# EAGLE design schematic (EAGLE 7.6.0)
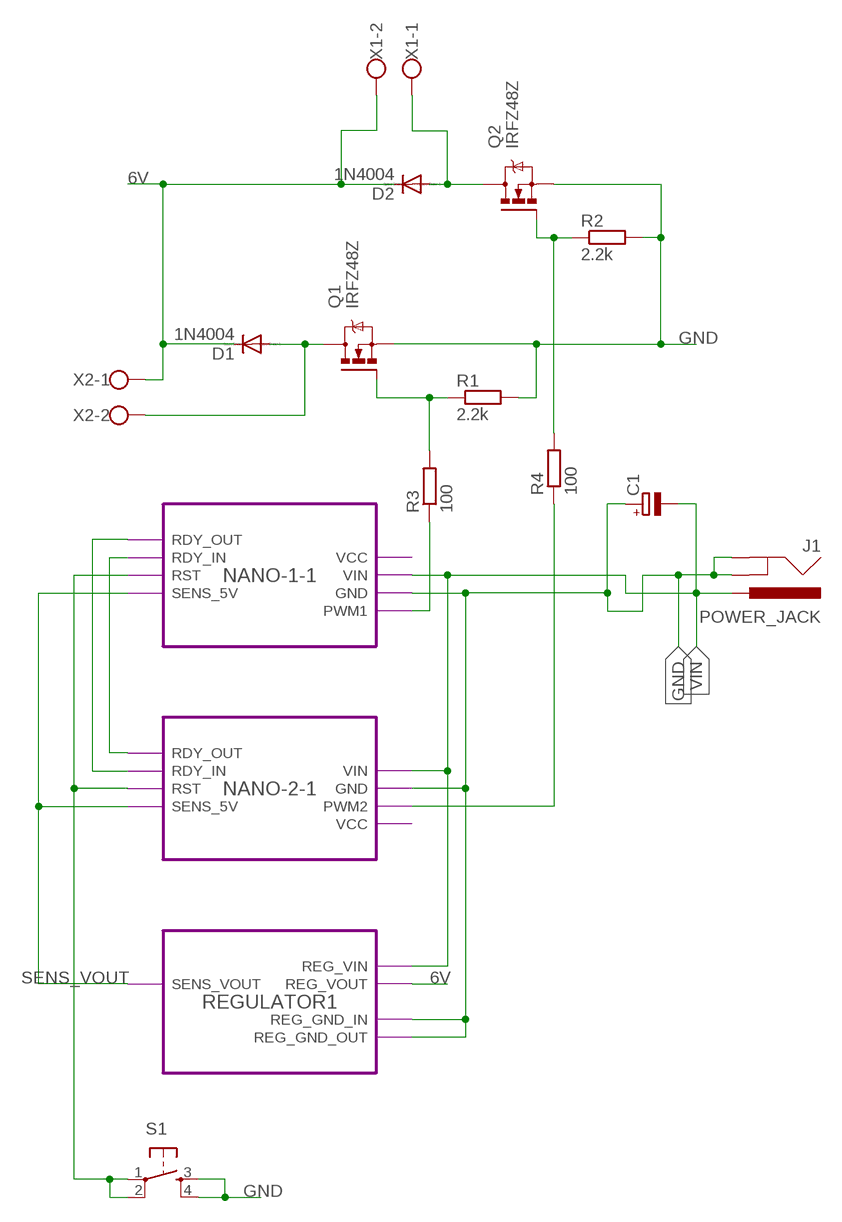
[diagram p0: schematic, sheet 1]

## Parts
C1  CPOL-EUE2.5-6  [E2,5-6]
D1  1N4004  [DO41-10]
D2  1N4004  [DO41-10]
J1  POWER_JACK  [POWER_JACK_PTH]
Q1  IRFZ48Z  [TO220BH]
Q2  IRFZ48Z  [TO220BH]
R1  2.2k  R-EU_0204/7  [0204/7]
R2  2.2k  R-EU_0204/7  [0204/7]
R3  100  R-EU_0204/7  [0204/7]
R4  100  R-EU_0204/7  [0204/7]
S1  TAC_SWITCHPTH  [TACTILE-PTH]
X1  W237-102  [W237-102]
X2  W237-102  [W237-102]

## Module instances
NANO-1-1 = NANO-1
NANO-2-1 = NANO-2
REGULATOR1 = REGULATOR

## Nets
6V: D1.C D2.C X1.2 X2.1 ; port REGULATOR1.REG_VOUT
GND: C1.+ J1.GND J1.GNDBREAK Q1.S Q2.S R1.2 R2.2 S1.3 S1.4 ; port NANO-2-1.GND NANO-1-1.GND REGULATOR1.REG_GND_OUT REGULATOR1.REG_GND_IN
N$1: Q1.G R1.1 R3.2
N$2: port NANO-2-1.RDY_OUT NANO-1-1.RDY_IN
N$3: R4.1 ; port NANO-2-1.PWM2
N$4: port NANO-1-1.RDY_OUT NANO-2-1.RDY_IN
N$5: D1.A Q1.D X2.2
N$6: D2.A Q2.D X1.1
N$7: R3.1 ; port NANO-1-1.PWM1
N$8: Q2.G R2.1 R4.2
N$9: S1.1 S1.2 ; port NANO-2-1.RST NANO-1-1.RST
SENS_VOUT: port REGULATOR1.SENS_VOUT NANO-2-1.SENS_5V NANO-1-1.SENS_5V
VIN: C1.- J1.PWR ; port NANO-1-1.VIN NANO-2-1.VIN REGULATOR1.REG_VIN

## Library data of the parts
C1 = rcl:CPOL-EU: POLARIZED CAPACITOR, European symbol
D1 D2 = diode:1N4004: DIODE general purpose rectifier, 1 A
J1 = SparkFun-Connectors:POWER_JACK: Power Jack Connector This is the standard 5.5mm barrel jack for power. The PTH is the most common, proven, reliable, footprint. The Slot footprint only works if the mill layer is transmitted to the PCB fab house so be warned. Here are the connectors we sell at SparkFun: DC Barrel Power Jack/Connector <https://www.sparkfun.com/products/119> (PRT-00119) DC Barrel Power Jack/Connector (SMD) <https://www.sparkfun.com/products/12748> (PRT-12748) DC Barrel Jack Adapter - Breadboard Compatible <https://www.sparkfun.com/products/10811> (PRT-10811) It is used on this SparkFun product (and many, many others): SparkFun RedBoard - Programmed with Arduino <https://www.sparkfun.com/products/12757> (DEV-12757) Also, if you need a mating power supply or connector, please check these out: Wall Adapter Power Supply - 9VDC 650mA <https://www.sparkfun.com/products/298> (TOL-00298) DC Barrel Jack Adapter - Male <https://www.sparkfun.com/products/10287> (PRT-10287); PROD_ID: CONN-08197
Q1 Q2 = transistor-power:IRFZ48: N Channel HEXFET® Power MOSFET Logic Level Source: http://www.irf.com/product-info/datasheets/data/irfz48z.pdf
R1-R4 = rcl:R-EU_: RESISTOR, European symbol
S1 = SparkFun-Retired:TAC_SWITCH: Momentary Switch Button commonly used for reset or general input. Spark Fun Electronics SKU : COM-00097 SMT- SWCH-08247
X1 X2 = con-wago-500:W237-102: WAGO SCREW CLAMP; MPN: 237-102; OC_FARNELL: unknown; OC_NEWARK: 70K9898

## Module NANO-1
Ports: VIN(io) GND(io) PWM1(io) VCC(io) RDY_OUT(io) RDY_IN(io) RST(io) SENS_5V(io)
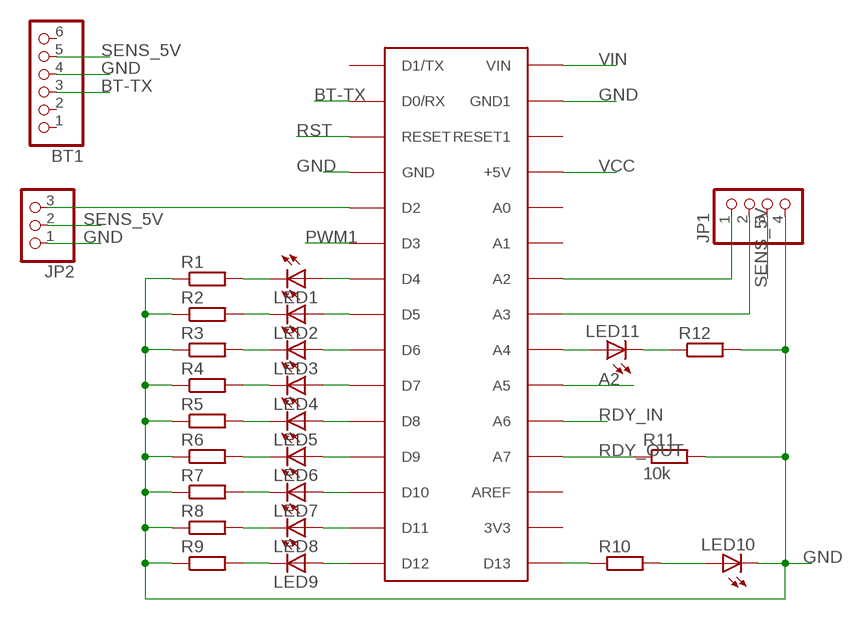
[diagram p1: schematic, module NANO-1, sheet 1]

### Parts
BT1  PINHD-1X6  [1X06]
JP1  PINHD-1X4  [1X04]
JP2  PINHD-1X3  [1X03]
LED1  LED5MM  [LED5MM]
LED2  LED5MM  [LED5MM]
LED3  LED5MM  [LED5MM]
LED4  LED5MM  [LED5MM]
LED5  LED5MM  [LED5MM]
LED6  LED5MM  [LED5MM]
LED7  LED5MM  [LED5MM]
LED8  LED5MM  [LED5MM]
LED9  LED5MM  [LED5MM]
LED10  LED5MM  [LED5MM]
LED11  LED5MM  [LED5MM]
R1  R-EU_0204/7  [0204/7]
R2  R-EU_0204/7  [0204/7]
R3  R-EU_0204/7  [0204/7]
R4  R-EU_0204/7  [0204/7]
R5  R-EU_0204/7  [0204/7]
R6  R-EU_0204/7  [0204/7]
R7  R-EU_0204/7  [0204/7]
R8  R-EU_0204/7  [0204/7]
R9  R-EU_0204/7  [0204/7]
R10  R-EU_0204/7  [0204/7]
R11  10k  R-EU_0204/7  [0204/7]
R12  R-EU_0204/7  [0204/7]
U$1  ARDUINONANO  [PDIP-32]

### Nets
A2: U$1.A5
BT-TX: BT1.3 U$1.D0/RX
GND: BT1.4 JP1.4 JP2.1 LED10.K(C) R1.1 R2.1 R3.1 R4.1 R5.1 R6.1 R7.1 R8.1 R9.1 R11.2 R12.2 U$1.GND U$1.GND1
N$1: LED9.A U$1.D12
N$2: LED8.A U$1.D11
N$3: LED7.A U$1.D10
N$4: LED6.A U$1.D9
N$5: LED5.A U$1.D8
N$6: LED4.A U$1.D7
N$7: LED3.A U$1.D6
N$8: LED2.A U$1.D5
N$9: LED1.A U$1.D4
N$10: R10.1 U$1.D13
N$11: LED1.K(C) R1.2
N$12: LED2.K(C) R2.2
N$13: LED3.K(C) R3.2
N$14: LED4.K(C) R4.2
N$15: LED5.K(C) R5.2
N$16: LED6.K(C) R6.2
N$17: LED7.K(C) R7.2
N$18: LED8.K(C) R8.2
N$19: LED9.K(C) R9.2
N$20: LED11.A U$1.A4
N$21: LED11.K(C) R12.1
N$22: LED10.A R10.2
N$23: JP1.1 U$1.A2
N$24: JP1.2 U$1.A3
N$25: JP2.3 U$1.D2
PWM1: U$1.D3
RDY_IN: U$1.A6
RDY_OUT: R11.1 U$1.A7
RST: U$1.RESET
SENS_5V: BT1.5 JP1.3 JP2.2
VCC: U$1.+5V
VIN: U$1.VIN
Unconnected: BT1.1 BT1.2 BT1.6 U$1.3V3 U$1.A0 U$1.A1 U$1.AREF U$1.D1/TX U$1.RESET1

### Library data of the parts
BT1 = pinhead:PINHD-1X6: PIN HEADER
JP1 = pinhead:PINHD-1X4: PIN HEADER
JP2 = pinhead:PINHD-1X3: PIN HEADER
LED1-LED11 = led:LED: LED OSRAM: - CHIPLED LG R971, LG N971, LY N971, LG Q971, LY Q971, LO R971, LY R971 LH N974, LH R974 LS Q976, LO Q976, LY Q976 LO Q996 - Hyper CHIPLED LW Q18S LB Q993, LB Q99A, LB R99A - SideLED LS A670, LO A670, LY A670, LG A670, LP A670 LB A673, LV A673, LT A673, LW A673 LH A674 LY A675 LS A676, LA A676, LO A676, LY A676, LW A676 LS A679, LY A679, LG A679 - Hyper Micro SIDELED® LS Y876, LA Y876, LO Y876, LY Y876 LT Y87S - SmartLED LW L88C, LW L88S LB L89C, LB L89S, LG L890 LS L89K, LO L89K, LY L89K LS L896, LA L896, LO L896, LY L896 - TOPLED LS T670, LO T670, LY T670, LG T670, LP T670 LSG T670, LSP T670, LSY T670, LOP T670, LYG T670 LG T671, LOG T671, LSG T671 LB T673, LV T673, LT T673, LW T673 LH T674 LS T676, LA T676, LO T676, LY T676, LB T676, LH T676, LSB T676, LW T676 LB T67C, LV T67C, LT T67C, LS T67K, LO T67K, LY T67K, LW E67C LS E67B, LA E67B, LO E67B, LY E67B, LB E67C, LV E67C, LT E67C LW T67C LS T679, LY T679, LG T679 LS T770, LO T770, LY T770, LG T770, LP T770 LB T773, LV T773, LT T773, LW T773 LH T774 LS E675, LA E675, LY E675, LS T675 LS T776, LA T776, LO T776, LY T776, LB T776 LHGB T686 LT T68C, LB T68C - Hyper Mini TOPLED® LB M676 - Mini TOPLED Santana® LG M470 LS M47K, LO M47K, LY M47K Source: http://www.osram.convergy.de LUXEON: - LUMILED® LXK2-PW12-R00, LXK2-PW12-S00, LXK2-PW14-U00, LXK2-PW14-V00 LXK2-PM12-R00, LXK2-PM12-S00, LXK2-PM14-U00 LXK2-PE12-Q00, LXK2-PE12-R00, LXK2-PE12-S00, LXK2-PE14-T00, LXK2-PE14-U00 LXK2-PB12-K00, LXK2-PB12-L00, LXK2-PB12-M00, LXK2-PB14-N00, LXK2-PB14-P00, LXK2-PB14-Q00 LXK2-PR12-L00, LXK2-PR12-M00, LXK2-PR14-Q00, LXK2-PR14-R00 LXK2-PD12-Q00, LXK2-PD12-R00, LXK2-PD12-S00 LXK2-PH12-R00, LXK2-PH12-S00 LXK2-PL12-P00, LXK2-PL12-Q00, LXK2-PL12-R00 Source: www.luxeon.com KINGBRIGHT: KA-3528ASYC Source: www.kingbright.com
R1-R12 = rcl:R-EU_: RESISTOR, European symbol
U$1 = jet-lib:ARDUINONANO

## Module NANO-2
Ports: VIN(io) GND(io) PWM2(io) VCC(io) RDY_OUT(io) RDY_IN(io) RST(io) SENS_5V(io)
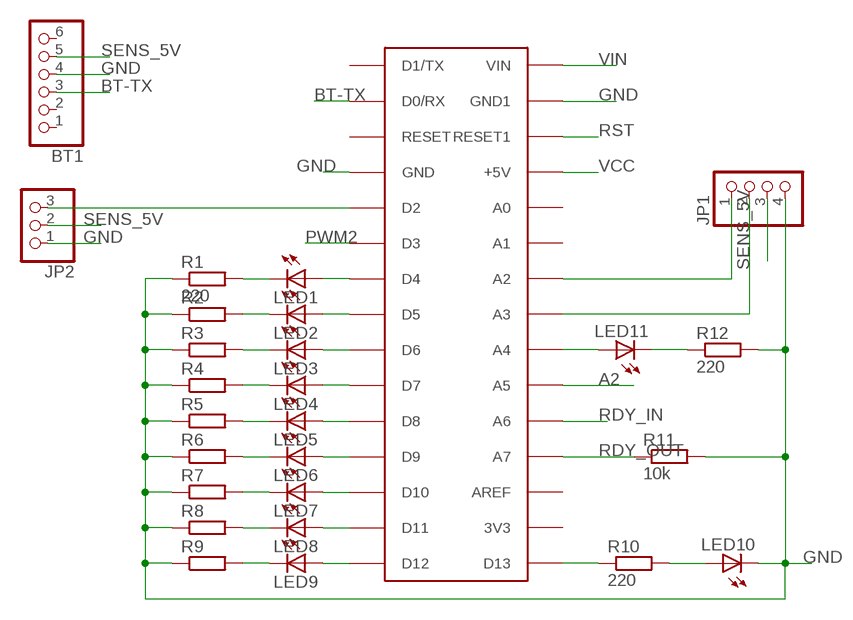
[diagram p2: schematic, module NANO-2, sheet 1]

### Parts
BT1  PINHD-1X6  [1X06]
JP1  PINHD-1X4  [1X04]
JP2  PINHD-1X3  [1X03]
LED1  LED5MM  [LED5MM]
LED2  LED5MM  [LED5MM]
LED3  LED5MM  [LED5MM]
LED4  LED5MM  [LED5MM]
LED5  LED5MM  [LED5MM]
LED6  LED5MM  [LED5MM]
LED7  LED5MM  [LED5MM]
LED8  LED5MM  [LED5MM]
LED9  LED5MM  [LED5MM]
LED10  LED5MM  [LED5MM]
LED11  LED5MM  [LED5MM]
R1  220  R-EU_0204/7  [0204/7]
R2  R-EU_0204/7  [0204/7]
R3  R-EU_0204/7  [0204/7]
R4  R-EU_0204/7  [0204/7]
R5  R-EU_0204/7  [0204/7]
R6  R-EU_0204/7  [0204/7]
R7  R-EU_0204/7  [0204/7]
R8  R-EU_0204/7  [0204/7]
R9  R-EU_0204/7  [0204/7]
R10  220  R-EU_0204/7  [0204/7]
R11  10k  R-EU_0204/7  [0204/7]
R12  220  R-EU_0204/7  [0204/7]
U$1  ARDUINONANO  [PDIP-32]

### Nets
A2: U$1.A5
BT-TX: BT1.3 U$1.D0/RX
GND: BT1.4 JP1.4 JP2.1 LED10.K(C) R1.1 R2.1 R3.1 R4.1 R5.1 R6.1 R7.1 R8.1 R9.1 R11.2 R12.2 U$1.GND U$1.GND1
N$1: LED9.A U$1.D12
N$2: LED8.A U$1.D11
N$3: LED7.A U$1.D10
N$4: LED6.A U$1.D9
N$5: LED5.A U$1.D8
N$6: LED4.A U$1.D7
N$7: LED3.A U$1.D6
N$8: LED2.A U$1.D5
N$9: LED1.A U$1.D4
N$10: LED11.K(C) R12.1
N$11: LED1.K(C) R1.2
N$12: LED2.K(C) R2.2
N$13: LED3.K(C) R3.2
N$14: LED4.K(C) R4.2
N$15: LED5.K(C) R5.2
N$16: LED6.K(C) R6.2
N$17: LED7.K(C) R7.2
N$18: LED8.K(C) R8.2
N$19: LED9.K(C) R9.2
N$20: LED11.A U$1.A4
N$21: R10.1 U$1.D13
N$22: LED10.A R10.2
N$23: JP1.1 U$1.A2
N$24: JP1.2 U$1.A3
N$25: JP2.3 U$1.D2
PWM2: U$1.D3
RDY_IN: U$1.A6
RDY_OUT: R11.1 U$1.A7
RST: U$1.RESET1
SENS_5V: BT1.5 JP1.3 JP2.2
VCC: U$1.+5V
VIN: U$1.VIN
Unconnected: BT1.1 BT1.2 BT1.6 U$1.3V3 U$1.A0 U$1.A1 U$1.AREF U$1.D1/TX U$1.RESET

### Library data of the parts
BT1 = pinhead:PINHD-1X6: PIN HEADER
JP1 = pinhead:PINHD-1X4: PIN HEADER
JP2 = pinhead:PINHD-1X3: PIN HEADER
LED1-LED11 = led:LED: LED OSRAM: - CHIPLED LG R971, LG N971, LY N971, LG Q971, LY Q971, LO R971, LY R971 LH N974, LH R974 LS Q976, LO Q976, LY Q976 LO Q996 - Hyper CHIPLED LW Q18S LB Q993, LB Q99A, LB R99A - SideLED LS A670, LO A670, LY A670, LG A670, LP A670 LB A673, LV A673, LT A673, LW A673 LH A674 LY A675 LS A676, LA A676, LO A676, LY A676, LW A676 LS A679, LY A679, LG A679 - Hyper Micro SIDELED® LS Y876, LA Y876, LO Y876, LY Y876 LT Y87S - SmartLED LW L88C, LW L88S LB L89C, LB L89S, LG L890 LS L89K, LO L89K, LY L89K LS L896, LA L896, LO L896, LY L896 - TOPLED LS T670, LO T670, LY T670, LG T670, LP T670 LSG T670, LSP T670, LSY T670, LOP T670, LYG T670 LG T671, LOG T671, LSG T671 LB T673, LV T673, LT T673, LW T673 LH T674 LS T676, LA T676, LO T676, LY T676, LB T676, LH T676, LSB T676, LW T676 LB T67C, LV T67C, LT T67C, LS T67K, LO T67K, LY T67K, LW E67C LS E67B, LA E67B, LO E67B, LY E67B, LB E67C, LV E67C, LT E67C LW T67C LS T679, LY T679, LG T679 LS T770, LO T770, LY T770, LG T770, LP T770 LB T773, LV T773, LT T773, LW T773 LH T774 LS E675, LA E675, LY E675, LS T675 LS T776, LA T776, LO T776, LY T776, LB T776 LHGB T686 LT T68C, LB T68C - Hyper Mini TOPLED® LB M676 - Mini TOPLED Santana® LG M470 LS M47K, LO M47K, LY M47K Source: http://www.osram.convergy.de LUXEON: - LUMILED® LXK2-PW12-R00, LXK2-PW12-S00, LXK2-PW14-U00, LXK2-PW14-V00 LXK2-PM12-R00, LXK2-PM12-S00, LXK2-PM14-U00 LXK2-PE12-Q00, LXK2-PE12-R00, LXK2-PE12-S00, LXK2-PE14-T00, LXK2-PE14-U00 LXK2-PB12-K00, LXK2-PB12-L00, LXK2-PB12-M00, LXK2-PB14-N00, LXK2-PB14-P00, LXK2-PB14-Q00 LXK2-PR12-L00, LXK2-PR12-M00, LXK2-PR14-Q00, LXK2-PR14-R00 LXK2-PD12-Q00, LXK2-PD12-R00, LXK2-PD12-S00 LXK2-PH12-R00, LXK2-PH12-S00 LXK2-PL12-P00, LXK2-PL12-Q00, LXK2-PL12-R00 Source: www.luxeon.com KINGBRIGHT: KA-3528ASYC Source: www.kingbright.com
R1-R12 = rcl:R-EU_: RESISTOR, European symbol
U$1 = jet-lib:ARDUINONANO

## Module REGULATOR
Ports: REG_VIN(io) REG_VOUT(io) REG_GND_IN(io) REG_GND_OUT(io) SENS_VOUT(io)
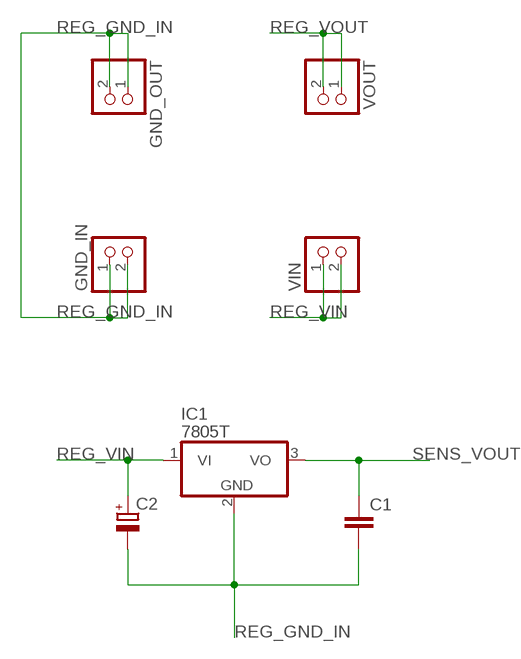
[diagram p3: schematic, module REGULATOR, sheet 1]

### Parts
C1  C-EU050-035X075  [C050-035X075]
C2  CPOL-EUE2.5-5  [E2,5-5]
GND_IN  PINHD-1X2  [1X02]
GND_OUT  PINHD-1X2  [1X02]
IC1  7805T  [TO220H]
VIN  PINHD-1X2  [1X02]
VOUT  PINHD-1X2  [1X02]

### Nets
REG_GND_IN: C1.2 C2.- GND_IN.1 GND_IN.2 GND_OUT.1 GND_OUT.2 IC1.2(GND)
REG_VIN: C2.+ IC1.1(VI) VIN.1 VIN.2
REG_VOUT: VOUT.1 VOUT.2
SENS_VOUT: C1.1 IC1.3(VO)

### Library data of the parts
C1 = rcl:C-EU: CAPACITOR, European symbol
C2 = rcl:CPOL-EU: POLARIZED CAPACITOR, European symbol
GND_IN GND_OUT VIN VOUT = pinhead:PINHD-1X2: PIN HEADER
IC1 = linear:78*: Positive VOLTAGE REGULATOR Source: http://cache.national.com/ds/LM/LM78L05.pdf http://www.fairchildsemi.com/ds/LM/LM7805.pdf

## Net classes
0 default: width 0.889 mm, drill 0.762 mm, clearance 0.762 mm

## Board
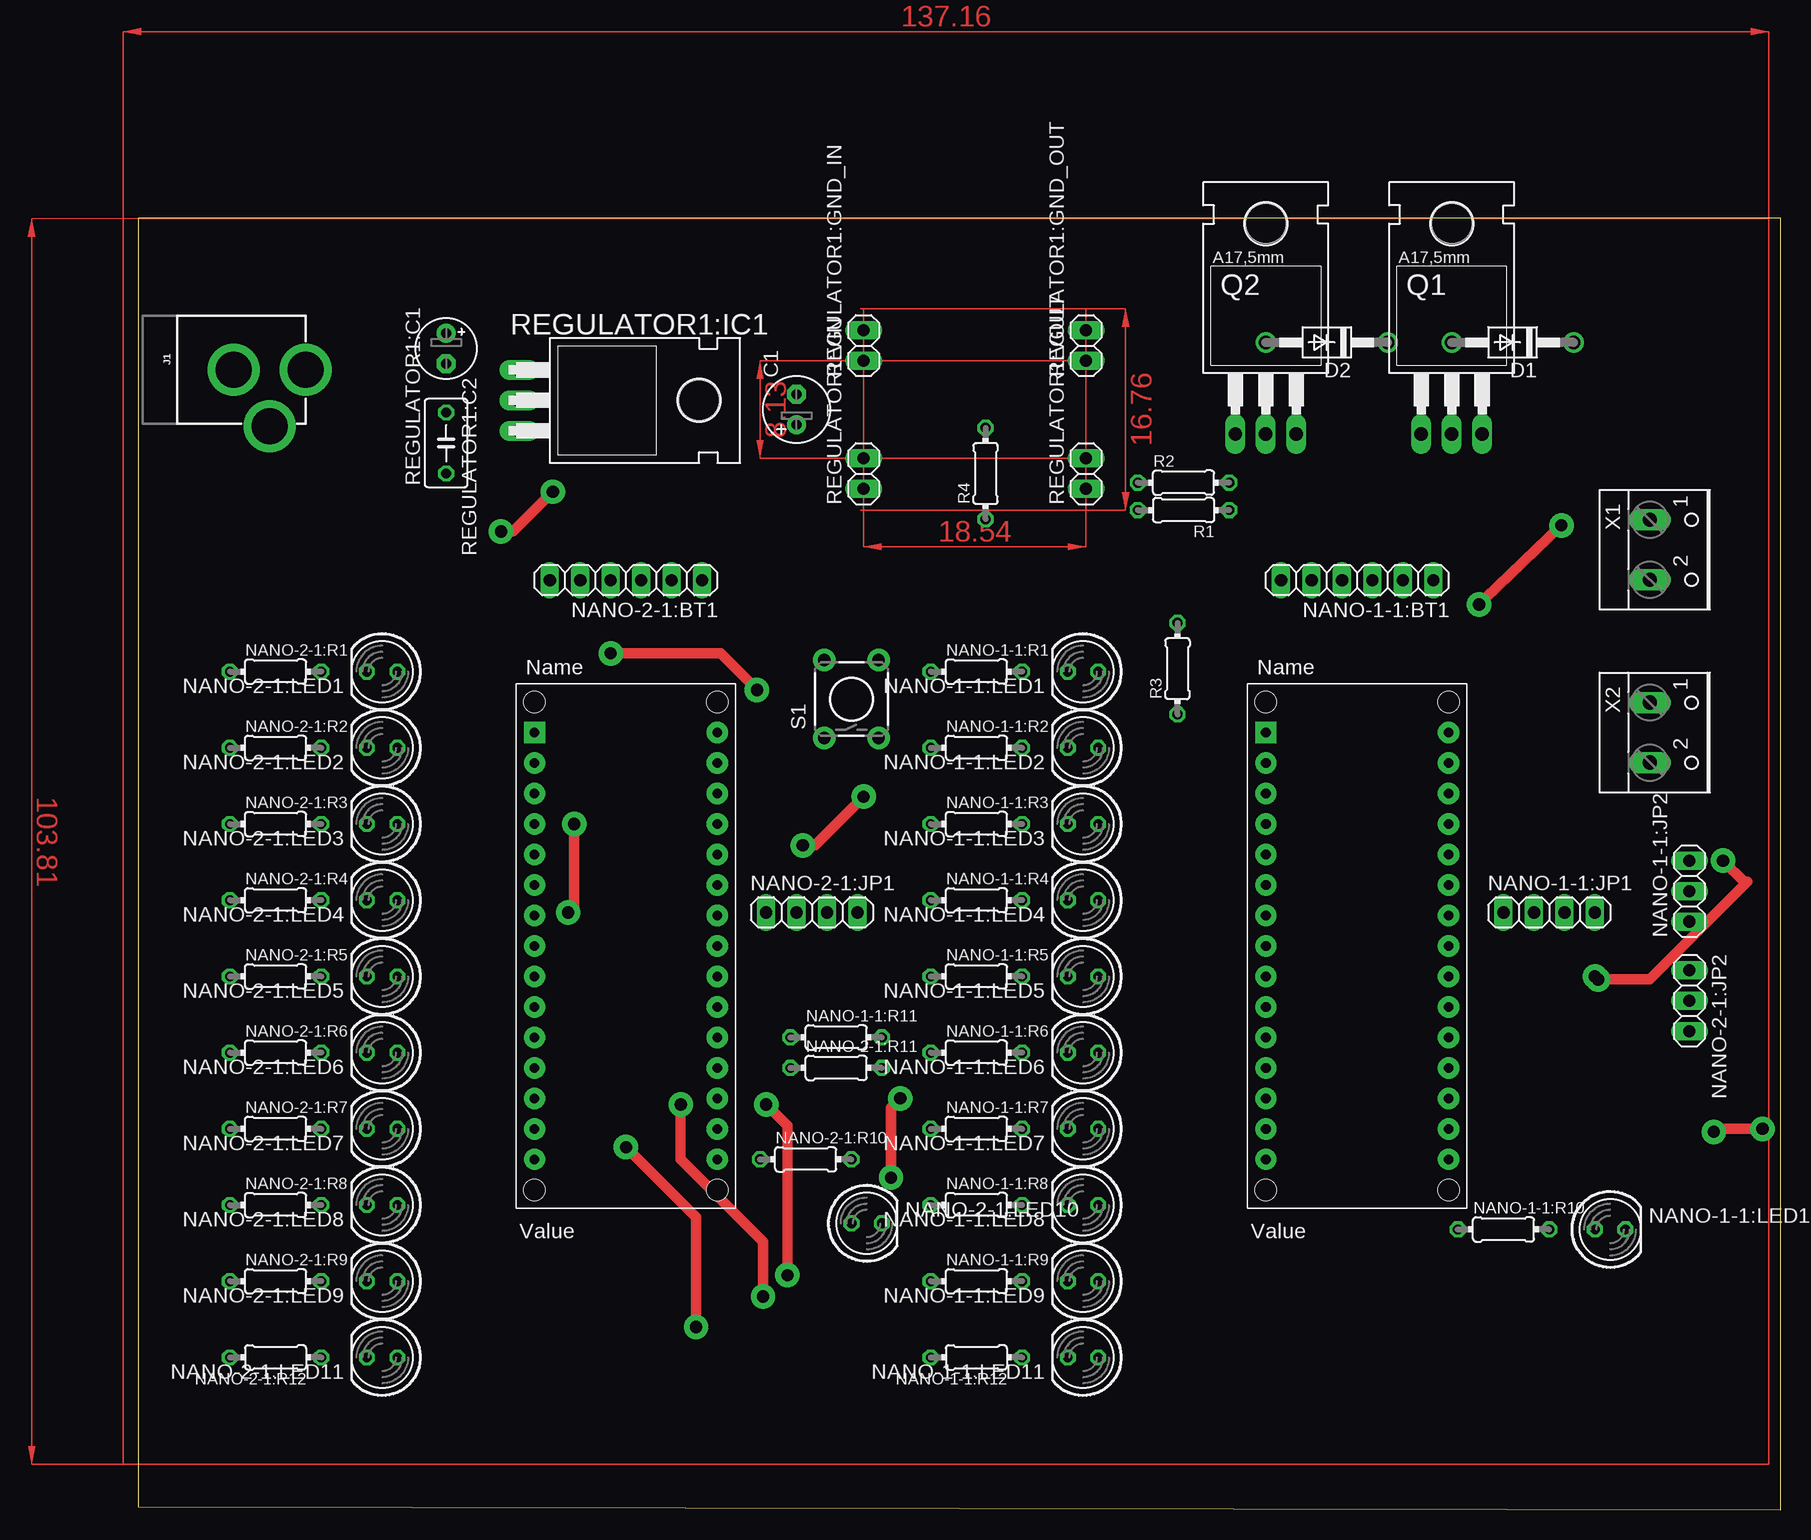
[diagram p4: board, top side]
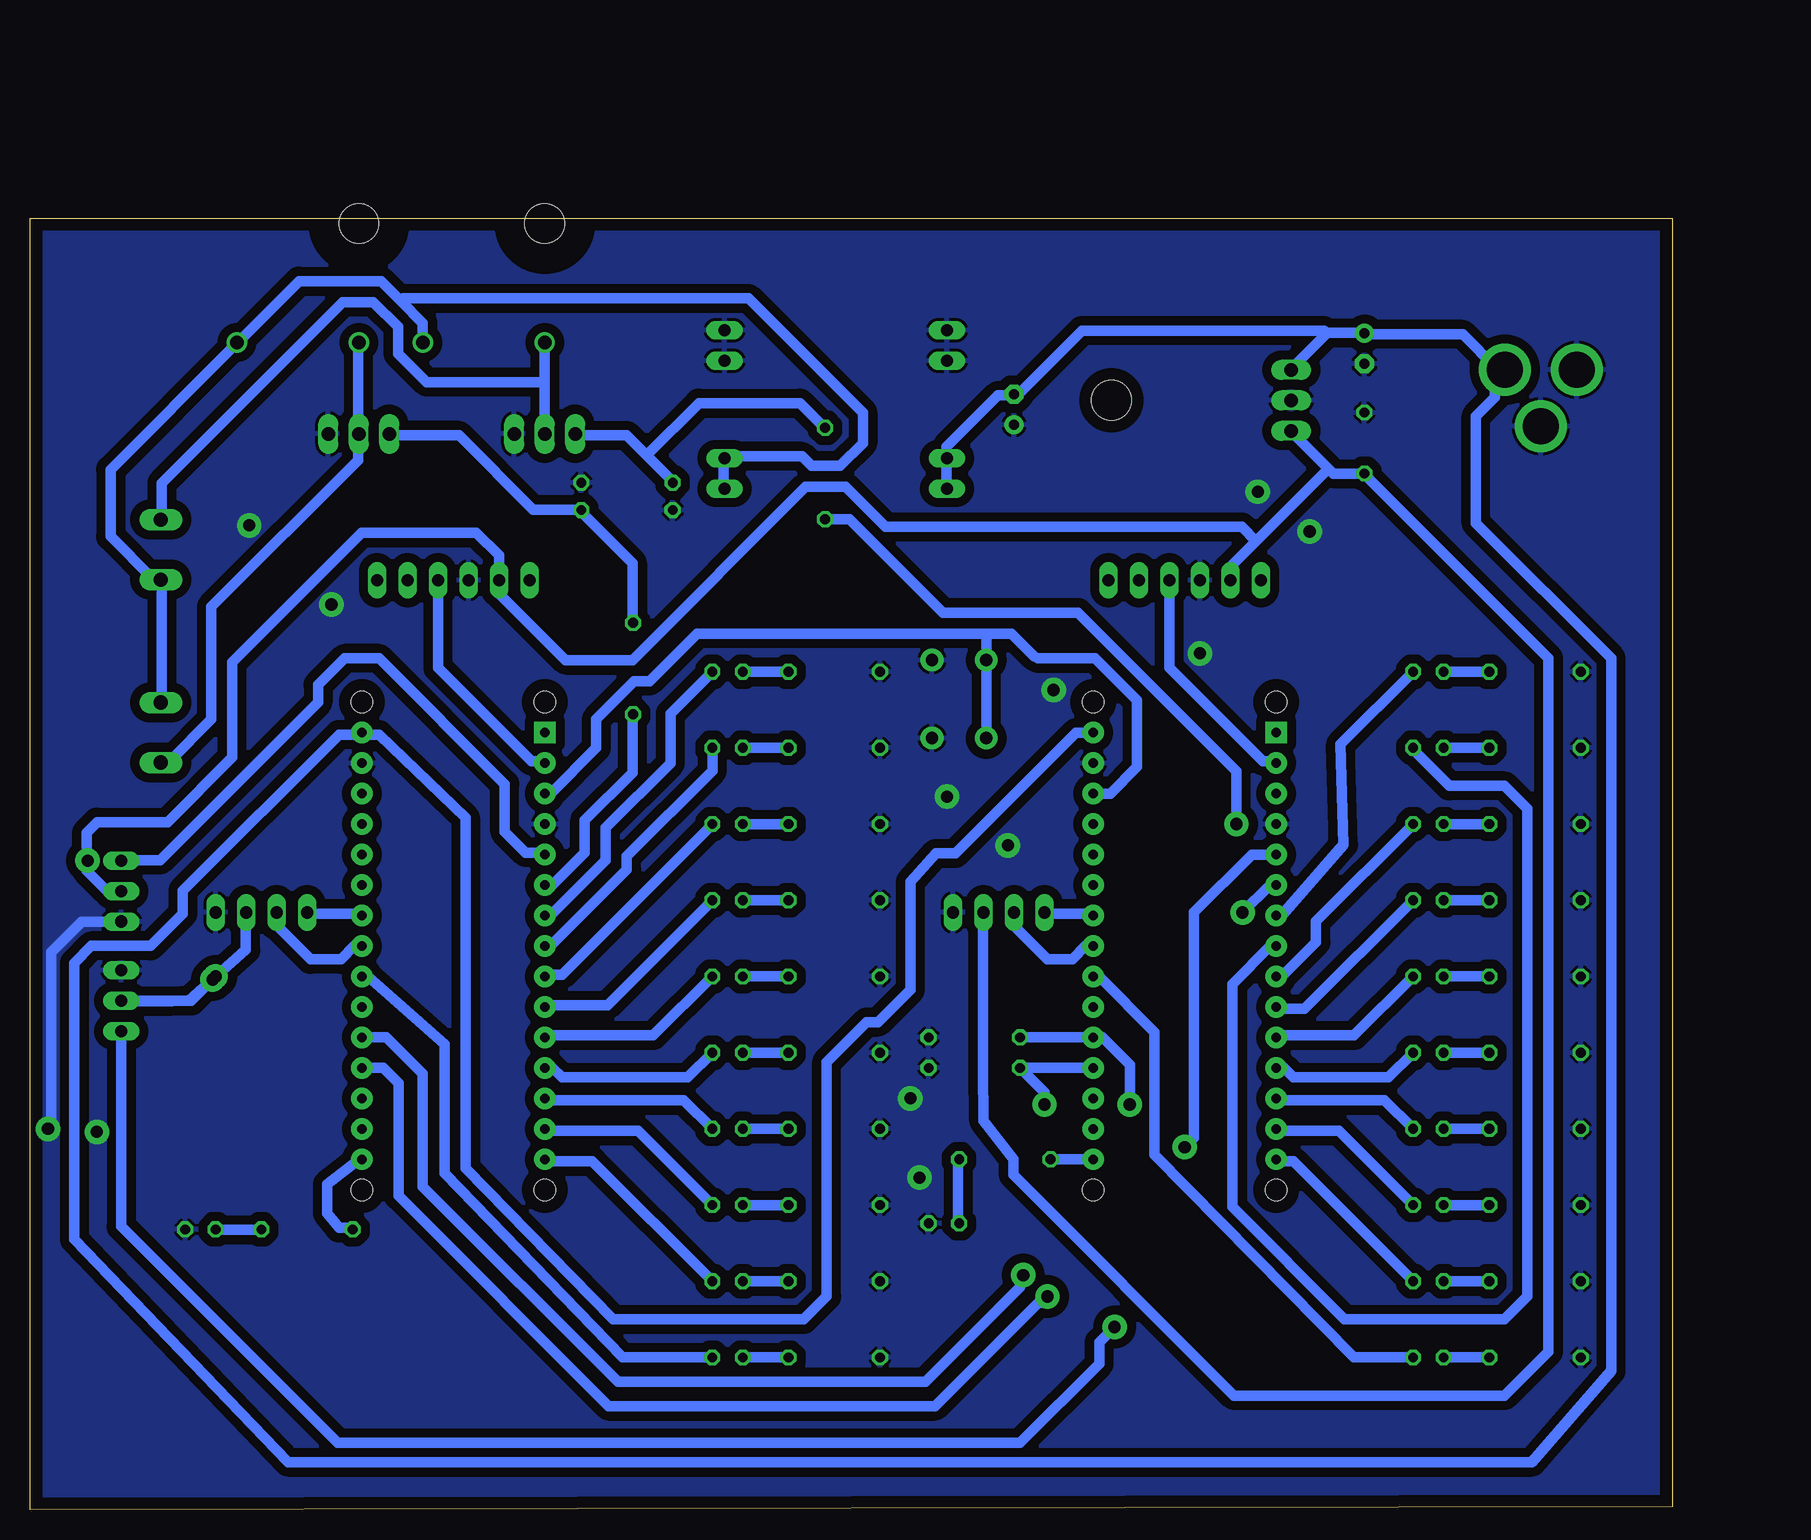
[diagram p5: board, bottom side, seen from below]

Size 136.89 x 107.62 mm. Coordinates in mm from the lower left corner, seen from the top.
Outline: 0,0.25 136.89,0 136.89,107.62 0,107.62 0,0.25
Copper layers (1*16): Top 0.035mm / dielectric 1.5mm / Bottom 0.035mm
Design rules "default": minimum track width 10mil, minimum drill 24mil, track to track 8mil, track to pad 8mil, pad to pad 8mil, via to via 8mil, smd to smd 8mil, copper to edge 40mil, drill to drill 8mil, minimum pad ring 10mil, minimum via ring 8mil, stop-mask expansion 4mil, vias tented up to drill 0mil, thermal gap 10mil

### Footprints (pad centres in the part's own frame; a part is rotated, then mirrored left to right if it is on the bottom)
E2,5-6 = drill 0.813 pad 1.6: + -1.27,0 | drill 0.813 pad 1.6 octagon: - 1.27,0
DO41-10 = drill 1.118: A 5.08,0; C -5.08,0
POWER_JACK_PTH = drill 2.997 pad 4.318: GND 0,7.7; GNDBREAK 4.7,10.7; PWR 0,13.7
1X06 = drill 1.016 long: 1 -6.35,0; 2 -3.81,0; 3 -1.27,0; 4 1.27,0; 5 3.81,0; 6 6.35,0
1X04 = drill 1.016 long: 1 -3.81,0; 2 -1.27,0; 3 1.27,0; 4 3.81,0
1X03 = drill 1.016 long: 1 -2.54,0; 2 0,0; 3 2.54,0
LED5MM = drill 0.813 octagon: A -1.27,0; K 1.27,0
0204/7 = drill 0.813 octagon: 1 -3.81,0; 2 3.81,0
PDIP-32 = drill 0.8 pad 1.778: 3V3 15.24,-35.56; +5V 15.24,-10.16; A0 15.24,-12.7; A1 15.24,-15.24; A2 15.24,-17.78; A3 15.24,-20.32; A4 15.24,-22.86; A5 15.24,-25.4; A6 15.24,-27.94; A7 15.24,-30.48; AREF 15.24,-33.02; D0/RX 0,-5.08; D2 0,-12.7; D3 0,-15.24; D4 0,-17.78; D5 0,-20.32; D6 0,-22.86; D7 0,-25.4; D8 0,-27.94; D9 0,-30.48; D10 0,-33.02; D11 0,-35.56; D12 0,-38.1; D13 15.24,-38.1; GND 0,-10.16; GND1 15.24,-5.08; RESET 0,-7.62; RESET1 15.24,-7.62; VIN 15.24,-2.54 | drill 0.8 pad 1.778 square: D1/TX 0,-2.54 | hole 1.778: 0,0; 0,-40.64; 15.24,-40.64; 15.24,0
TO220BH = drill 1.118 long: D 0,-6.35; G -2.54,-6.35; S 2.54,-6.35 | hole 3.302: 0,11.176
C050-035X075 = drill 0.813 octagon: 1 -2.54,0; 2 2.54,0
E2,5-5 = drill 0.813 pad 1.6: + -1.27,0 | drill 0.813 pad 1.6 octagon: - 1.27,0
1X02 = drill 1.016 long: 1 -1.27,0; 2 1.27,0
TO220H = drill 1.118 long: 1 -2.54,-10.16; 2 0,-10.16; 3 2.54,-10.16 | hole 3.302: 0,4.826
TACTILE-PTH = drill 1.016 pad 1.88: 1 -3.251,2.261; 2 3.251,2.261; 3 -3.251,-2.261; 4 3.251,-2.261
W237-102 = drill 1.194 long: 1 -2.5,-1.27; 2 2.5,-1.27

### Placement (x,y rotation side)
C1  54.86,91.69 90 top
D1  114.55,97.28 180 top
D2  99.06,97.28 180 top
J1  0.25,95 270 top
NANO-1-1:BT1  [1X06]  101.6,77.47 180 top
NANO-1-1:JP1  [1X04]  117.6,49.78 0 top
NANO-1-1:JP2  [1X03]  129.29,51.56 90 top
NANO-1-1:LED1  [LED5MM]  78.74,69.85 180 top
NANO-1-1:LED2  [LED5MM]  78.74,63.5 180 top
NANO-1-1:LED3  [LED5MM]  78.74,57.15 180 top
NANO-1-1:LED4  [LED5MM]  78.74,50.8 180 top
NANO-1-1:LED5  [LED5MM]  78.74,44.45 180 top
NANO-1-1:LED6  [LED5MM]  78.74,38.1 180 top
NANO-1-1:LED7  [LED5MM]  78.74,31.75 180 top
NANO-1-1:LED8  [LED5MM]  78.74,25.4 180 top
NANO-1-1:LED9  [LED5MM]  78.74,19.05 180 top
NANO-1-1:LED10  [LED5MM]  122.68,23.37 0 top
NANO-1-1:LED11  [LED5MM]  78.74,12.7 180 top
NANO-1-1:R1  [0204/7]  69.85,69.85 0 top
NANO-1-1:R2  [0204/7]  69.85,63.5 0 top
NANO-1-1:R3  [0204/7]  69.85,57.15 0 top
NANO-1-1:R4  [0204/7]  69.85,50.8 0 top
NANO-1-1:R5  [0204/7]  69.85,44.45 0 top
NANO-1-1:R6  [0204/7]  69.85,38.1 0 top
NANO-1-1:R7  [0204/7]  69.85,31.75 0 top
NANO-1-1:R8  [0204/7]  69.85,25.4 0 top
NANO-1-1:R9  [0204/7]  69.85,19.05 0 top
NANO-1-1:R10  [0204/7]  113.79,23.37 0 top
NANO-1-1:R11  10k  [0204/7]  58.17,39.37 0 top
NANO-1-1:R12  [0204/7]  69.85,12.7 180 top
NANO-1-1:U$1  ARDUINONANO  [PDIP-32]  93.98,67.31 0 top
NANO-2-1:BT1  [1X06]  40.64,77.47 180 top
NANO-2-1:JP1  [1X04]  56.13,49.78 0 top
NANO-2-1:JP2  [1X03]  129.29,42.42 270 top
NANO-2-1:LED1  [LED5MM]  20.32,69.85 180 top
NANO-2-1:LED2  [LED5MM]  20.32,63.5 180 top
NANO-2-1:LED3  [LED5MM]  20.32,57.15 180 top
NANO-2-1:LED4  [LED5MM]  20.32,50.8 180 top
NANO-2-1:LED5  [LED5MM]  20.32,44.45 180 top
NANO-2-1:LED6  [LED5MM]  20.32,38.1 180 top
NANO-2-1:LED7  [LED5MM]  20.32,31.75 180 top
NANO-2-1:LED8  [LED5MM]  20.32,25.4 180 top
NANO-2-1:LED9  [LED5MM]  20.32,19.05 180 top
NANO-2-1:LED10  [LED5MM]  60.71,23.88 0 top
NANO-2-1:LED11  [LED5MM]  20.32,12.7 180 top
NANO-2-1:R1  220  [0204/7]  11.43,69.85 0 top
NANO-2-1:R2  [0204/7]  11.43,63.5 0 top
NANO-2-1:R3  [0204/7]  11.43,57.15 0 top
NANO-2-1:R4  [0204/7]  11.43,50.8 0 top
NANO-2-1:R5  [0204/7]  11.43,44.45 0 top
NANO-2-1:R6  [0204/7]  11.43,38.1 0 top
NANO-2-1:R7  [0204/7]  11.43,31.75 0 top
NANO-2-1:R8  [0204/7]  11.43,25.4 0 top
NANO-2-1:R9  [0204/7]  11.43,19.05 0 top
NANO-2-1:R10  220  [0204/7]  55.63,29.21 0 top
NANO-2-1:R11  10k  [0204/7]  58.17,36.83 0 top
NANO-2-1:R12  220  [0204/7]  11.43,12.7 180 top
NANO-2-1:U$1  ARDUINONANO  [PDIP-32]  33.02,67.31 0 top
Q1  109.47,96.01 0 top
Q2  93.98,96.01 0 top
R1  87.12,83.31 180 top
R2  87.12,85.6 0 top
R3  86.61,70.1 90 top
R4  70.61,86.36 90 top
REGULATOR1:C1  [C050-035X075]  25.65,88.9 90 top
REGULATOR1:C2  [E2,5-5]  25.65,96.77 270 top
REGULATOR1:GND_IN  [1X02]  60.45,97.03 90 top
REGULATOR1:GND_OUT  [1X02]  78.99,97.03 90 top
REGULATOR1:IC1  7805T  [TO220H]  41.91,92.46 270 top
REGULATOR1:VIN  [1X02]  60.45,86.36 90 top
REGULATOR1:VOUT  [1X02]  78.99,86.36 90 top
S1  59.44,67.56 90 top
X1  127.25,80.01 270 top
X2  127.25,64.77 270 top

### Tracks (layer width: path | path; a pad name or v marks a point on that pad's centre or on a via)
6V
  Bottom 0.889: X2.1 125.89,67.31 125.89,77.47 X1.2 126.36,77.63 126.68,77.63 130.17,81.12 130.17,86.68 119.86,97 D1.C 119.54,97.31 114.46,102.39 107.63,102.39 105.97,100.73 | REGULATOR1:VOUT.1 79.06,85.09 79.06,87.63 REGULATOR1:VOUT.2 78.58,87.79 72.55,87.79 71.75,86.99 69.37,86.99 67.47,88.9 67.47,91.44 76.99,100.96 105.73,100.96 105.97,100.73 | D2.C 104.14,98.9 105.97,100.73
GND  (via drill 1.02 pad 2.03)
  Top 0.889: v111.76,75.44 112.27,75.95 v118.62,82.04 | v39.37,71.37 48.51,71.37 v51.56,68.33 | v55.37,55.37 56.39,55.37 v60.45,59.44 | v62.74,27.69 62.74,33.53 v63.5,34.29 | v30.23,81.53 31.24,81.53 v34.54,84.84 | v135.38,31.75 131.57,31.75 v131.32,31.5
  Bottom 0.889: NANO-1-1:JP2.1 132.59,49.02 135.13,46.48 135.13,32 v135.38,31.75
  pour Bottom: -41.91,107.95 -41.91,-6.35 148.59,-6.35 148.59,120.65 -41.91,120.65
N$1
  Bottom 0.889: R3.2 86.68,73.98 86.68,78.9 90.96,83.18 R1.1 91.28,83.34 94.93,83.34 101.12,89.53 106.84,89.53 Q1.G
N$2  (via drill 1.02 pad 2.03)
  Top 0.889: v54.1,19.56 54.1,32 v52.32,33.78
  Bottom 0.889: NANO-2-1:U$1.A7 NANO-2-1:R11.1 52.32,34.8 v52.32,33.78 | NANO-1-1:U$1.A6 107.19,39.37 104.14,36.32 104.14,26.92 87.88,10.67 62.23,10.67 54.36,18.54 54.36,19.3 v54.1,19.56
N$3  (via drill 1.02 pad 2.03)
  Top 0.889: v36.32,57.15 36.32,50.29 v35.81,49.78
  Bottom 0.889: R4.1 68.58,82.55 60.8,74.77 49.53,74.77 36.32,61.56 v36.32,57.15 | NANO-2-1:U$1.D3 33.53,52.07 v35.81,49.78
N$4  (via drill 1.02 pad 2.03)
  Top 0.889: v52.07,17.78 52.07,22.35 45.21,29.21 v45.21,33.78
  Bottom 0.889: NANO-1-1:R11.1 NANO-2-1:U$1.A6 47.5,39.37 45.21,37.08 v45.21,33.78 | NANO-1-1:U$1.A7 107.44,36.83 106.17,35.56 106.17,26.16 88.65,8.64 61.47,8.64 52.83,17.27 52.58,17.27 v52.07,17.78
N$5
  Bottom 0.889: D1.A 109.54,97.16 109.54,89.69 Q1.D 109.54,89.22 109.54,87.47 121.76,75.25 121.76,65.88 125.25,62.39 125.89,62.39 X2.2
N$6
  Bottom 0.889: D2.A 93.98,93.98 | 93.98,93.98 Q2.D | 93.98,93.98 103.82,93.98 106.2,96.36 106.2,98.58 108.27,100.65 110.81,100.65 125.89,85.57 125.89,82.55 X1.1
N$7
  Bottom 0.889: NANO-1-1:U$1.D3 93.34,52.07 90.65,54.77 90.65,57.47 86.68,61.44 86.68,66.2 R3.1
N$8
  Bottom 0.889: 85.49,87.87 87.15,89.53 91.44,89.53 Q2.G | 85.49,87.87 83.34,85.72 R2.1 | 85.49,87.87 81.12,92.23 72.71,92.23 70.64,90.17 R4.2
N$9
  Bottom 0.889: NANO-2-1:U$1.RESET1 46.83,59.69 44.61,61.91 44.61,67.47 48.1,70.96 52.86,70.96 53.18,71.12 55.09,73.02 57.15,73.02 | NANO-1-1:U$1.RESET 93.5,59.69 89.69,63.5 89.69,65.88 86.52,69.06 85.25,69.06 81.28,73.02 57.15,73.02 | S1.1 S1.2 57.18,73 57.15,73.02
NANO-1-1:BT-TX
  Bottom 0.889: NANO-1-1:BT1.3 102.87,70.17 95.09,62.39 94.14,62.39 NANO-1-1:U$1.D0/RX
NANO-1-1:N$1
  Bottom 0.889: NANO-1-1:LED9.A 90.01,29.05 93.82,29.05 NANO-1-1:U$1.D12
NANO-1-1:N$2
  Bottom 0.889: NANO-1-1:LED8.A 86.2,31.59 93.82,31.59 NANO-1-1:U$1.D11
NANO-1-1:N$3
  Bottom 0.889: NANO-1-1:LED7.A 82.39,34.13 93.82,34.13 NANO-1-1:U$1.D10
NANO-1-1:N$4
  Bottom 0.889: NANO-1-1:LED6.A 82.07,36.04 92.55,36.04 93.34,36.83 NANO-1-1:U$1.D9
NANO-1-1:N$5
  Bottom 0.889: NANO-1-1:LED5.A 84.93,39.53 93.82,39.53 NANO-1-1:U$1.D8
NANO-1-1:N$6
  Bottom 0.889: NANO-1-1:LED4.A 88.74,42.07 93.82,42.07 NANO-1-1:U$1.D7
NANO-1-1:N$7
  Bottom 0.889: NANO-1-1:LED3.A 92.55,44.61 93.82,44.61 NANO-1-1:U$1.D6
NANO-1-1:N$8
  Bottom 0.889: NANO-1-1:LED2.A 80.01,61.59 87.15,54.45 87.15,53.34 93.5,46.99 NANO-1-1:U$1.D5
NANO-1-1:N$9
  Bottom 0.889: NANO-1-1:LED1.A 83.5,66.36 83.5,62.23 88.9,56.83 88.9,54.13 93.5,49.53 NANO-1-1:U$1.D4
NANO-1-1:N$10
  Bottom 0.889: NANO-1-1:U$1.D13 109.38,29.21 109.7,29.02 112.11,27.12 112.11,24.73 111.12,23.49 110.01,23.49 NANO-1-1:R10.1
NANO-1-1:N$11
  Bottom 0.889: NANO-1-1:LED1.K NANO-1-1:R1.2
NANO-1-1:N$12
  Bottom 0.889: NANO-1-1:LED2.K NANO-1-1:R2.2
NANO-1-1:N$13
  Bottom 0.889: NANO-1-1:LED3.K NANO-1-1:R3.2
NANO-1-1:N$14
  Bottom 0.889: NANO-1-1:LED4.K NANO-1-1:R4.2
NANO-1-1:N$15
  Bottom 0.889: NANO-1-1:LED5.K NANO-1-1:R5.2
NANO-1-1:N$16
  Bottom 0.889: NANO-1-1:LED6.K NANO-1-1:R6.2
NANO-1-1:N$17
  Bottom 0.889: NANO-1-1:LED7.K NANO-1-1:R7.2
NANO-1-1:N$18
  Bottom 0.889: NANO-1-1:LED8.K NANO-1-1:R8.2
NANO-1-1:N$19
  Bottom 0.889: NANO-1-1:LED9.K NANO-1-1:R9.2
NANO-1-1:N$20
  Bottom 0.889: NANO-1-1:LED11.A 87.47,12.7 102.33,28.07 102.33,38.8 108.74,44.45 NANO-1-1:U$1.A4
NANO-1-1:N$21
  Bottom 0.889: NANO-1-1:LED11.K NANO-1-1:R12.1
NANO-1-1:N$22
  Bottom 0.889: NANO-1-1:R10.2 117.63,23.34 121.28,23.34 NANO-1-1:LED10.A
NANO-1-1:N$23
  Bottom 0.889: NANO-1-1:U$1.A2 109.38,49.69 113.66,49.69 NANO-1-1:JP1.1
NANO-1-1:N$24
  Bottom 0.889: NANO-1-1:U$1.A3 109.85,46.99 110.97,45.88 113.51,45.88 116.2,48.58 116.2,49.69 NANO-1-1:JP1.2
NANO-1-1:N$25
  Bottom 0.889: NANO-1-1:U$1.D2 94.14,54.77 95.57,54.77 97.31,56.52 97.31,60.48 107.79,70.96 110.65,70.96 112.87,68.74 112.87,67.31 126.05,54.13 129.22,54.13 NANO-1-1:JP2.3
NANO-2-1:BT-TX
  Bottom 0.889: NANO-2-1:BT1.3 41.91,70.17 34.13,62.39 33.18,62.39 NANO-2-1:U$1.D0/RX
NANO-2-1:N$1
  Bottom 0.889: NANO-2-1:LED9.A 31.59,29.05 32.86,29.05 NANO-2-1:U$1.D12
NANO-2-1:N$2
  Bottom 0.889: NANO-2-1:LED8.A 27.78,31.59 32.86,31.59 NANO-2-1:U$1.D11
NANO-2-1:N$3
  Bottom 0.889: NANO-2-1:LED7.A 23.97,34.13 32.86,34.13 NANO-2-1:U$1.D10
NANO-2-1:N$4
  Bottom 0.889: NANO-2-1:LED6.A 23.65,36.04 31.59,36.04 32.38,36.83 NANO-2-1:U$1.D9
NANO-2-1:N$5
  Bottom 0.889: NANO-2-1:LED5.A 26.51,39.53 32.86,39.53 NANO-2-1:U$1.D8
NANO-2-1:N$6
  Bottom 0.889: NANO-2-1:LED4.A 30.64,41.75 32.86,41.75 NANO-2-1:U$1.D7
NANO-2-1:N$7
  Bottom 0.889: NANO-2-1:LED3.A 29.69,49.05 29.69,47.31 32.54,44.45 NANO-2-1:U$1.D6
NANO-2-1:N$8
  Bottom 0.889: NANO-2-1:LED2.A 21.59,63.34 18.57,60.33 13.97,60.33 12.06,58.42 12.06,17.78 13.97,15.88 27.3,15.88 36.67,25.24 36.67,43.82 33.5,46.99 NANO-2-1:U$1.D5
NANO-2-1:N$9
  Bottom 0.889: NANO-2-1:LED1.A 27.65,63.79 27.4,55.44 32.54,49.53 NANO-2-1:U$1.D4
NANO-2-1:N$10
  Bottom 0.889: NANO-2-1:LED11.K NANO-2-1:R12.1
NANO-2-1:N$11
  Bottom 0.889: NANO-2-1:LED1.K NANO-2-1:R1.2
NANO-2-1:N$12
  Bottom 0.889: NANO-2-1:LED2.K NANO-2-1:R2.2
NANO-2-1:N$13
  Bottom 0.889: NANO-2-1:LED3.K NANO-2-1:R3.2
NANO-2-1:N$14
  Bottom 0.889: NANO-2-1:LED4.K NANO-2-1:R4.2
NANO-2-1:N$15
  Bottom 0.889: NANO-2-1:LED5.K NANO-2-1:R5.2
NANO-2-1:N$16
  Bottom 0.889: NANO-2-1:LED6.K NANO-2-1:R6.2
NANO-2-1:N$17
  Bottom 0.889: NANO-2-1:LED7.K NANO-2-1:R7.2
NANO-2-1:N$18
  Bottom 0.889: NANO-2-1:LED8.K NANO-2-1:R8.2
NANO-2-1:N$19
  Bottom 0.889: NANO-2-1:LED9.K NANO-2-1:R9.2
NANO-2-1:N$20
  Bottom 0.889: NANO-2-1:LED11.A 26.51,12.7 43.15,29.59 43.15,39.82 47.78,44.45 NANO-2-1:U$1.A4
NANO-2-1:N$21
  Bottom 0.889: NANO-2-1:U$1.D13 NANO-2-1:R10.1
NANO-2-1:N$22
  Bottom 0.889: NANO-2-1:LED10.A 59.53,23.97 59.53,29.21 NANO-2-1:R10.2
NANO-2-1:N$23
  Bottom 0.889: NANO-2-1:U$1.A2 48.42,49.69 52.23,49.69 NANO-2-1:JP1.1
NANO-2-1:N$24
  Bottom 0.889: NANO-2-1:U$1.A3 48.9,46.99 50.01,45.88 52.07,45.88 54.77,48.58 54.77,49.69 NANO-2-1:JP1.2
NANO-2-1:N$25  (via drill 1.02 pad 2.03)
  Top 0.889: v46.48,15.24 46.48,24.38 v40.64,30.23
  Bottom 0.889: NANO-2-1:JP2.3 129.29,23.62 111.25,5.59 54.36,5.59 47.75,12.19 47.75,13.97 v46.48,15.24 | NANO-2-1:U$1.D2 35.05,54.61 39.88,49.78 39.88,30.99 v40.64,30.23
SENS_VOUT  (via drill 1.02 pad 2.03)
  Top 0.889: v121.67,44.2 125.98,44.2 134.11,52.32 133.86,52.32 v132.08,54.1
  Bottom 0.889: NANO-2-1:JP1.3 57.47,49.69 57.47,36.67 57.39,32.43 54.93,29.21 54.93,27.94 36.51,9.52 13.97,9.52 10.32,13.18 10.32,70.96 25.4,86.04 REGULATOR1:C1.1 28.26,86.36 28.65,86.76 | 123.63,42.45 118.9,46.67 118.9,49.69 NANO-1-1:JP1.3 | 123.63,42.45 125.06,42.39 129.22,42.39 NANO-2-1:JP2.2 123.44,42.42 123.41,42.45 | 28.65,86.76 31.75,89.85 REGULATOR1:IC1.3 | NANO-2-1:BT1.5 36.83,78.58 34.69,80.72 | 28.65,86.76 34.69,80.72 | 132.17,54.01 132.17,56.42 131.29,57.31 125.41,57.31 120.01,62.71 120.01,70.64 109.22,81.44 99.69,81.44 97.79,79.53 NANO-1-1:BT1.5 97.79,76.36 92.23,70.8 86.68,70.8 72.23,85.25 68.9,85.25 65.56,81.91 35.88,81.91 34.69,80.72 | NANO-1-1:JP2.2 129.38,51.59 130.49,51.59 132.17,53.28 132.17,54.01 | 132.17,54.01 v132.08,54.1 | 123.63,42.45 123.41,42.45 | 123.41,42.45 v121.67,44.2 v121.41,44.45
VIN
  Bottom 0.889: REGULATOR1:VIN.1 60.48,85.09 60.48,87.63 REGULATOR1:VIN.2 60.48,87.95 60.48,88.58 56.2,92.87 54.93,92.87 C1.- 54.45,93.03 49.21,98.27 29.05,98.27 28.73,98.11 | 28.73,98.11 25.72,98.11 REGULATOR1:C2.+ 25.24,97.95 17.46,97.95 14.6,95.09 13.97,95.09 J1.PWR 14.76,94.77 14.76,92.71 16.35,91.12 16.35,82.23 5.08,70.96 5.08,11.59 11.68,3.97 115.38,3.97 133.19,22.54 133.19,45.56 131.76,46.99 126.84,46.99 124.14,49.69 124.14,51.59 111.12,64.61 109.54,64.61 NANO-1-1:U$1.VIN 109.06,64.61 107.79,64.61 100.58,57.66 100.58,28.45 88.26,15.88 72.39,15.88 70.48,17.78 70.48,37.31 67.15,40.64 66.2,40.64 63.5,43.34 63.5,52.32 61.37,54.7 59.75,54.7 49.69,64.77 NANO-2-1:U$1.VIN | 28.73,98.11 31.75,95.09 REGULATOR1:IC1.1
(copper drawn outside any net)
  shapes: Top area x5